# EAGLE design transmitter2 (EAGLE 5.10)
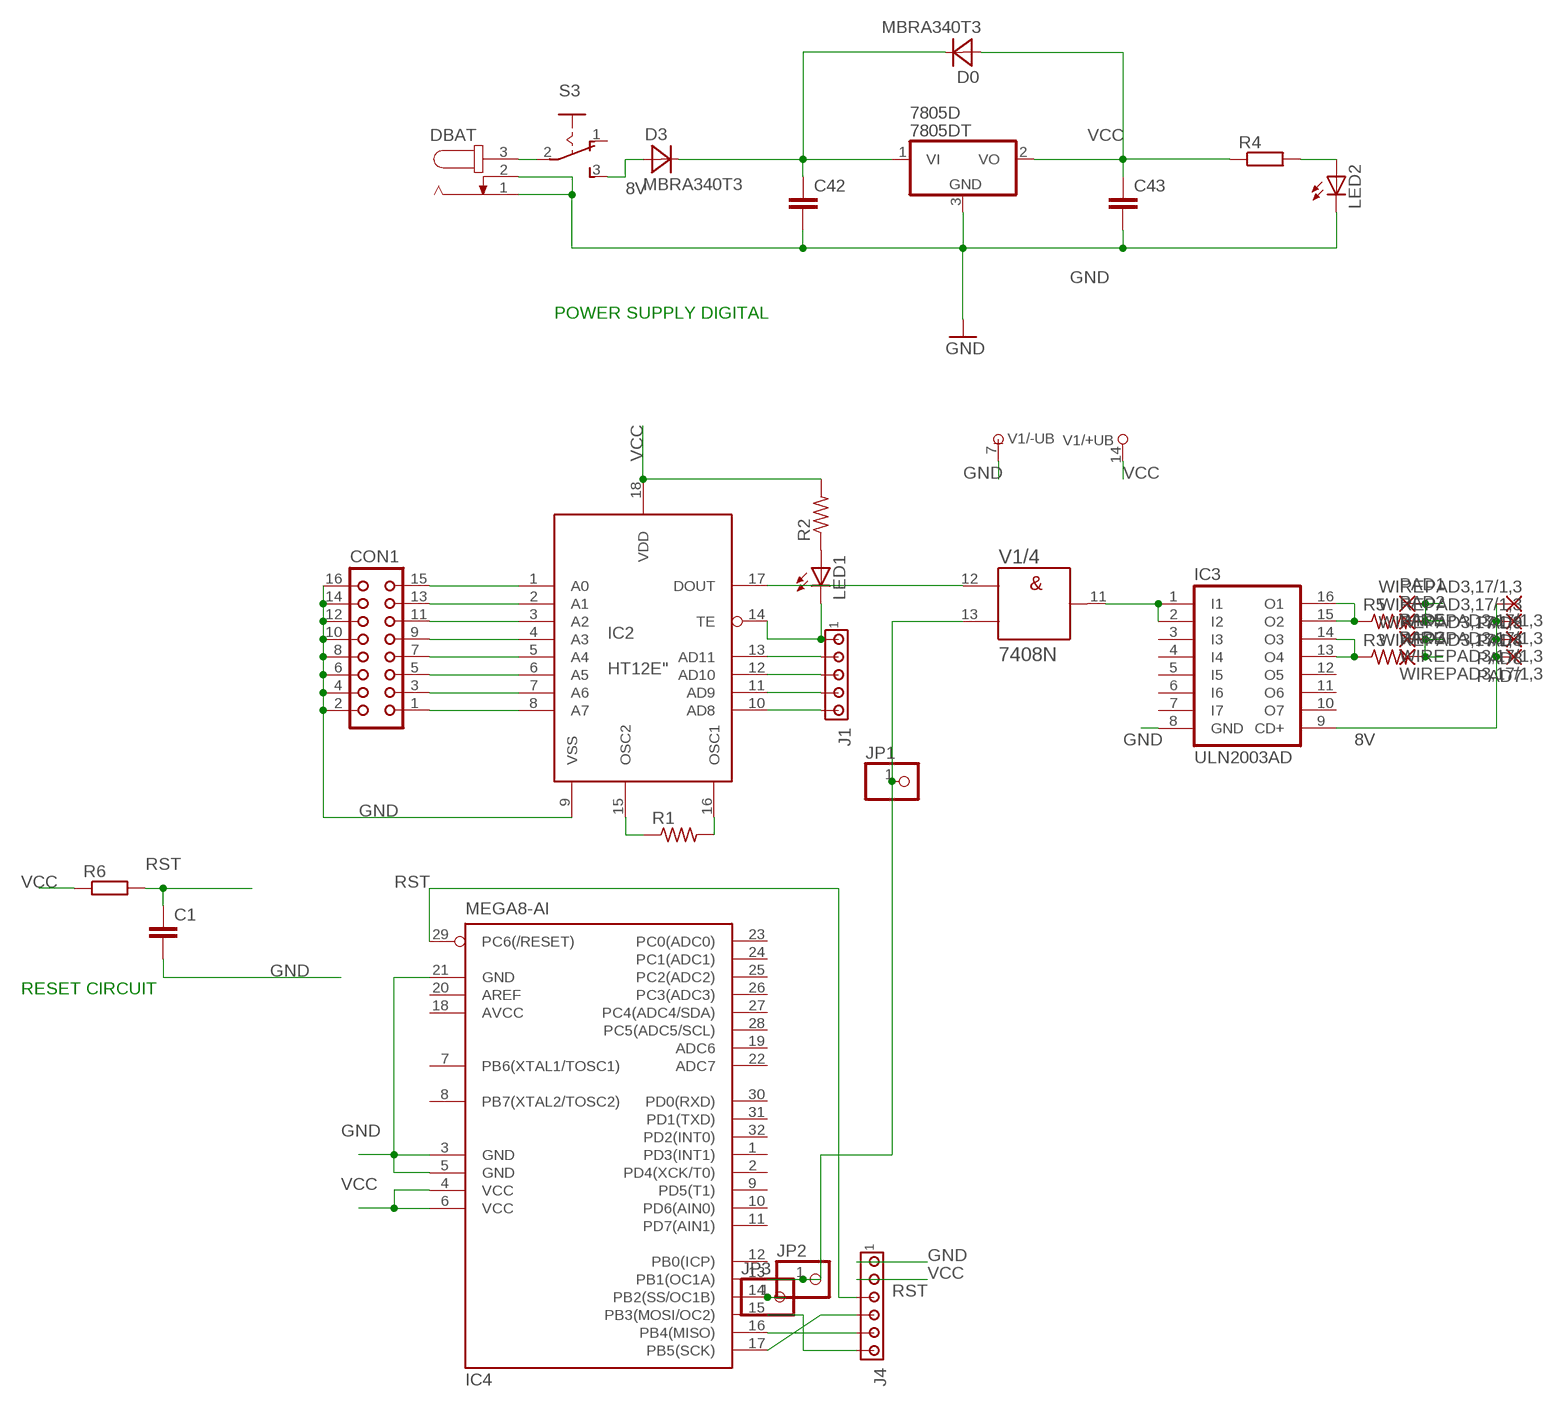
[diagram p0: schematic, sheet 1]

## Parts
7805D  7805DT  [TO252]
C1  C-EUC0603  [C0603]
C42  C-EUC0603  [C0603]
C43  C-EUC0603  [C0603]
CON1  CON16  [CON16]
D0  MBRA340T3  [SMA]
D3  MBRA340T3  [SMA]
DBAT  JACK-PLUG0  [SPC4077]
IC2  HT12E"  [18-DIP-A]
IC3  ULN2003AD  [SO16]
IC4  MEGA8-AI  [TQFP32-08]
J1  MTA05-100  [10X05MTA]
J4  MTA06-100  [10X06MTA]
JP1  PINHD-1X1  [1X01]
JP2  PINHD-1X1  [1X01]
JP3  PINHD-1X1  [1X01]
LED1  LED3MM  [LED3MM]
LED2  LED3MM  [LED3MM]
PAD1  WIREPAD3,17/1,3  [3,17/1,3]
PAD2  WIREPAD3,17/1,3  [3,17/1,3]
PAD3  WIREPAD3,17/1,3  [3,17/1,3]
PAD4  WIREPAD3,17/1,3  [3,17/1,3]
PAD5  WIREPAD3,17/1,3  [3,17/1,3]
PAD7  WIREPAD3,17/1,3  [3,17/1,3]
PAD8  WIREPAD3,17/1,3  [3,17/1,3]
PAD9  WIREPAD3,17/1,3  [3,17/1,3]
R1  R-US_VMTA55  [VMTA55]
R2  R-US_M1206  [M1206]
R3  R-US_0309/12  [0309/12]
R4  R-EU_R0603  [R0603]
R5  R-US_0309/12  [0309/12]
R6  R-EU_R0603  [R0603]
S3  255SB  [255SB]
V1  7408N  [DIL14]

## Nets
8V: D3.A IC3.9(CD+) PAD4.1(P) PAD7.1(P) PAD8.1(P) PAD9.1(P) S3.3(S)
GND: 7805D.3(GND) C1.2 C42.2 C43.2 CON1.2 CON1.4 CON1.6 CON1.8 CON1.10 CON1.12 CON1.14 CON1.16 DBAT.1 DBAT.2 IC2.9(VSS) IC3.8(GND) IC4.3(GND) IC4.5(GND) IC4.21(GND) J4.6 LED2.K(C) V1.7(/-UB:-UB)
N$1: CON1.15 IC2.1(A0)
N$2: CON1.13 IC2.2(A1)
N$3: CON1.11 IC2.3(A2)
N$4: CON1.9 IC2.4(A3)
N$5: CON1.7 IC2.5(A4)
N$6: DBAT.3 S3.2(P)
N$7: IC3.15(O2) IC3.16(O1) R5.1
N$8: LED2.A R4.2
N$9: CON1.5 IC2.6(A5)
N$10: CON1.3 IC2.7(A6)
N$11: CON1.1 IC2.8(A7)
N$12: IC2.13(AD11) J1.2
N$13: IC2.12(AD10) J1.3
N$14: IC2.11(AD9) J1.4
N$15: IC2.10(AD8) J1.5
N$16: IC2.16(OSC1) R1.2
N$17: IC2.15(OSC2) R1.1
N$18: IC4.13(PB1(OC1A)) JP1.1 JP2.1 V1.13(/4:B)
N$19: IC4.14(PB2(SS/OC1B)) JP3.1
N$20: IC3.13(O4) IC3.14(O3) R3.1
N$21: PAD3.1(P) PAD5.1(P) R3.2
N$22: IC2.17(DOUT) V1.12(/4:A)
N$24: LED1.A R2.1
N$25: IC3.1(I1) IC3.2(I2) V1.11(/4:Y)
N$26: IC4.15(PB3(MOSI/OC2)) J4.1
N$27: PAD1.1(P) PAD2.1(P) R5.2
N$28: IC4.16(PB4(MISO)) J4.2
N$29: IC4.17(PB5(SCK)) J4.3
RST: C1.1 IC4.29(PC6(/RESET)) J4.4 R6.2
TE: IC2.14(TE) J1.1 LED1.K(C)
VCC: 7805D.2(VO) C43.1 D0.A IC2.18(VDD) IC4.4(VCC) IC4.6(VCC) J4.5 R2.2 R4.1 R6.1 V1.14(/+UB:+UB)
VI(5D): 7805D.1(VI) C42.1 D0.C D3.C
Unconnected: IC3.3(I3) IC3.4(I4) IC3.5(I5) IC3.6(I6) IC3.7(I7) IC3.10(O7) IC3.11(O6) IC3.12(O5) IC4.1(PD3(INT1)) IC4.2(PD4(XCK/T0)) IC4.7(PB6(XTAL1/TOSC1)) IC4.8(PB7(XTAL2/TOSC2)) IC4.9(PD5(T1)) IC4.10(PD6(AIN0)) IC4.11(PD7(AIN1)) IC4.12(PB0(ICP)) IC4.19(ADC6) IC4.20(AREF) IC4.22(ADC7) IC4.23(PC0(ADC0)) IC4.24(PC1(ADC1)) IC4.25(PC2(ADC2)) IC4.26(PC3(ADC3)) IC4.27(PC4(ADC4/SDA)) IC4.28(PC5(ADC5/SCL)) IC4.30(PD0(RXD)) IC4.31(PD1(TXD)) IC4.32(PD2(INT0)) S3.1(O) V1.1(/1:A) V1.2(/1:B) V1.3(/1:Y) V1.4(/2:A) V1.5(/2:B) V1.6(/2:Y) V1.8(/3:Y) V1.9(/3:A) V1.10(/3:B)

## Notes on the sheet
- POWER SUPPLY DIGITAL
- RESET CIRCUIT

## Power pins joined to a net without a drawn wire
AVCC: IC4.18(AVCC)

## Library data of the parts
7805D = linear:78*: Positive VOLTAGE REGULATOR Source: http://cache.national.com/ds/LM/LM78L05.pdf http://www.fairchildsemi.com/ds/LM/LM7805.pdf
C1 C42 C43 = rcl:C-EU: CAPACITOR, European symbol
CON1 = con-harting:CON16: CONNECTOR
D0 D3 = diode:MBRA340T3: Surface Mount Schottky Power Rectifier Source: http://www.onsemi.com/pub_link/Collateral/MBRA340T3-D.PDF
DBAT = con-jack:JACK-PLUG: DC POWER JACK Power Jack, DC, Right Angle, Through Hole, Rated 5A at 16VDC, PC Terminals Distributor: Farnell (www.Farnell.de) Drawing: 84N1161.pdf / 84N1162.pdf Manufacturer: SPC Technology (www.spctechnology.com) Type: SPC4077 / SPC 4078
IC2 = holtek (2):HT12E: transmitter = encoder ic
IC3 = uln-udn:ULN2003A: DRIVER ARRAY
IC4 = atmel:MEGA8: MICROCONTROLLER 8 Kbytes FLASH, 1 kbytes SRAM, 512 bytes EEPROM, USART, 6-channel 10 bit ADC, 2-channel 8 bit ADC Pin compatible with Atmega48, ATMega88, ATMega168 Source: avr.lbr
J1 = con-amp:MTA05-100: AMP connector
J4 = con-amp:MTA06-100: AMP connector
JP1-JP3 = pinhead:PINHD-1X1: PIN HEADER
LED1 LED2 = led:LED: LED OSRAM: - CHIPLED LG R971, LG N971, LY N971, LG Q971, LY Q971, LO R971, LY R971 LH N974, LH R974 LS Q976, LO Q976, LY Q976 LO Q996 - Hyper CHIPLED LW Q18S LB Q993, LB Q99A, LB R99A - SideLED LS A670, LO A670, LY A670, LG A670, LP A670 LB A673, LV A673, LT A673, LW A673 LH A674 LY A675 LS A676, LA A676, LO A676, LY A676, LW A676 LS A679, LY A679, LG A679 - Hyper Micro SIDELED® LS Y876, LA Y876, LO Y876, LY Y876 LT Y87S - SmartLED LW L88C, LW L88S LB L89C, LB L89S, LG L890 LS L89K, LO L89K, LY L89K LS L896, LA L896, LO L896, LY L896 - TOPLED LS T670, LO T670, LY T670, LG T670, LP T670 LSG T670, LSP T670, LSY T670, LOP T670, LYG T670 LG T671, LOG T671, LSG T671 LB T673, LV T673, LT T673, LW T673 LH T674 LS T676, LA T676, LO T676, LY T676, LB T676, LH T676, LSB T676, LW T676 LB T67C, LV T67C, LT T67C, LS T67K, LO T67K, LY T67K, LW E67C LS E67B, LA E67B, LO E67B, LY E67B, LB E67C, LV E67C, LT E67C LW T67C LS T679, LY T679, LG T679 LS T770, LO T770, LY T770, LG T770, LP T770 LB T773, LV T773, LT T773, LW T773 LH T774 LS E675, LA E675, LY E675, LS T675 LS T776, LA T776, LO T776, LY T776, LB T776 LHGB T686 LT T68C, LB T68C - Hyper Mini TOPLED® LB M676 - Mini TOPLED Santana® LG M470 LS M47K, LO M47K, LY M47K Source: http://www.osram.convergy.de LUXEON: - LUMILED® LXK2-PW12-R00, LXK2-PW12-S00, LXK2-PW14-U00, LXK2-PW14-V00 LXK2-PM12-R00, LXK2-PM12-S00, LXK2-PM14-U00 LXK2-PE12-Q00, LXK2-PE12-R00, LXK2-PE12-S00, LXK2-PE14-T00, LXK2-PE14-U00 LXK2-PB12-K00, LXK2-PB12-L00, LXK2-PB12-M00, LXK2-PB14-N00, LXK2-PB14-P00, LXK2-PB14-Q00 LXK2-PR12-L00, LXK2-PR12-M00, LXK2-PR14-Q00, LXK2-PR14-R00 LXK2-PD12-Q00, LXK2-PD12-R00, LXK2-PD12-S00 LXK2-PH12-R00, LXK2-PH12-S00 LXK2-PL12-P00, LXK2-PL12-Q00, LXK2-PL12-R00 Source: www.luxeon.com KINGBRIGHT: KA-3528ASYC Source: www.kingbright.com
PAD1-PAD5 PAD7-PAD9 = wirepad:WIREPAD: Wire PAD connect wire on PCB
R1-R3 R5 = rcl:R-US_: RESISTOR, American symbol
R4 R6 = resistor:R-EU_: RESISTOR, European symbol
S3 = switch:255SB: SLIDING SWITCH Distributor Buerklin, 11G810
V1 = 74ttl-din:74*08: Quad 2-input AND gate

## Board
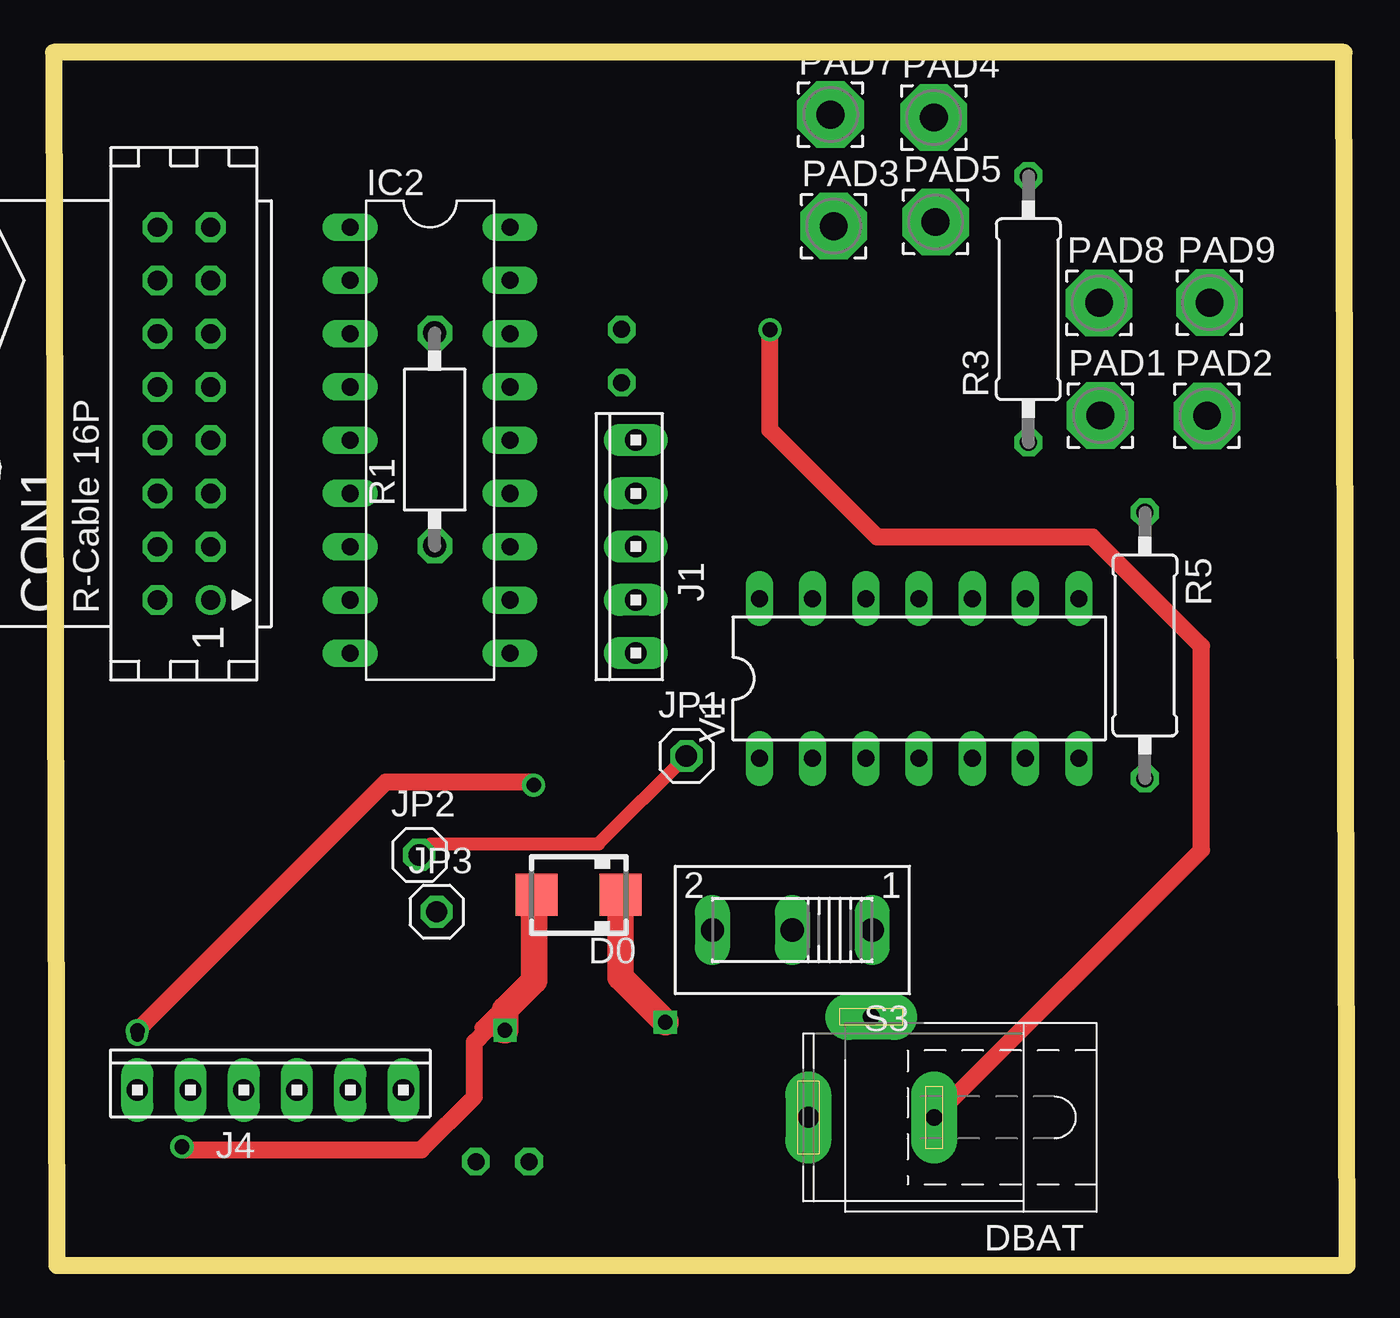
[diagram p1: board, top side]
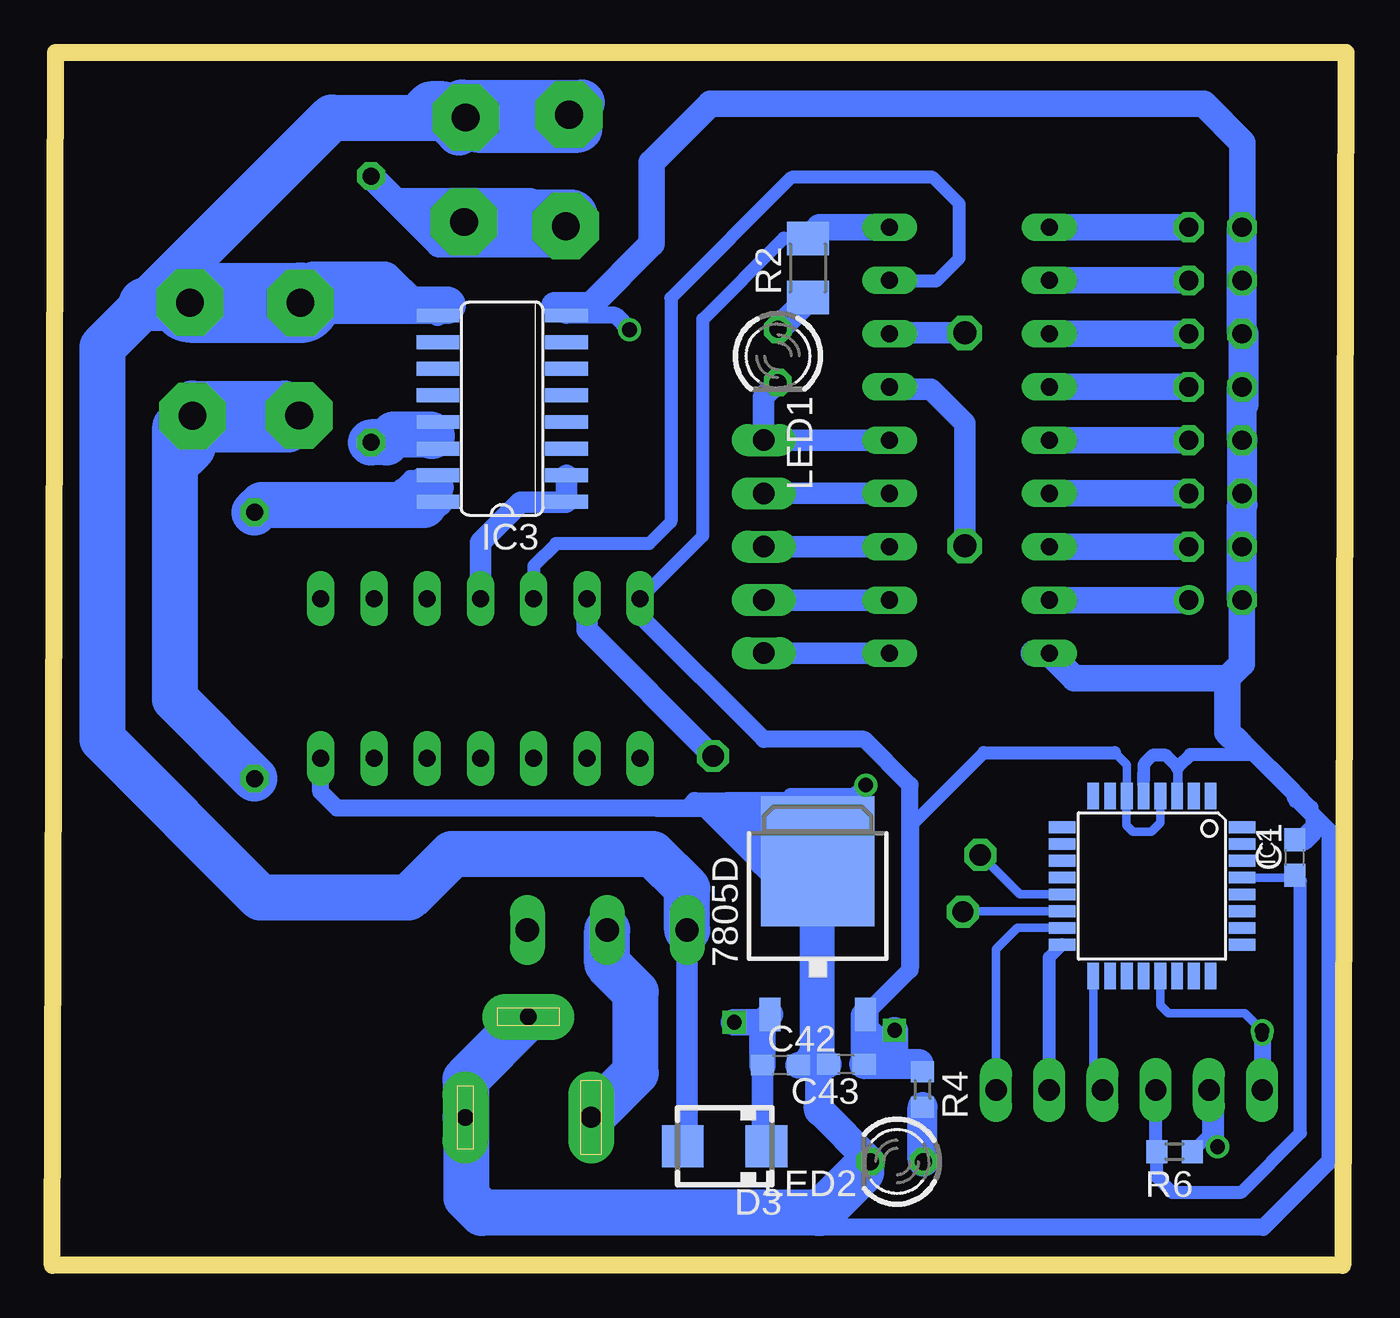
[diagram p2: board, bottom side, seen from below]

Size 61.72 x 57.85 mm. Coordinates in mm from the lower left corner, seen from the top.
Outline: 0.16,0 61.72,0 61.56,57.85 0,57.85 0.16,0
Copper layers (1*16): Top 0.035mm / dielectric 1.5mm / Bottom 0.035mm
Design rules "default": minimum track width 10mil, minimum drill 24mil, track to track 8mil, track to pad 8mil, pad to pad 8mil, via to via 8mil, smd to smd 8mil, copper to edge 40mil, drill to drill 8mil, minimum pad ring 10mil, minimum via ring 8mil, stop-mask expansion 4mil, vias tented up to drill 0mil, thermal gap 10mil

### Footprints (pad centres in the part's own frame; a part is rotated, then mirrored left to right if it is on the bottom)
TO252 = smd 1 x 1.6: 1 -2.28,-4.8; 2 2.28,-4.8 | smd 5.4 x 6.2: 3 0,2.5
C0603 = smd 1.1 x 1: 1 -0.85,0; 2 0.85,0
CON16 = drill 0.914 round: 1 -8.89,-1.27 | drill 0.914 octagon: 2 -8.89,1.27; 3 -6.35,-1.27; 4 -6.35,1.27; 5 -3.81,-1.27; 6 -3.81,1.27; 7 -1.27,-1.27; 8 -1.27,1.27; 9 1.27,-1.27; 10 1.27,1.27; 11 3.81,-1.27; 12 3.81,1.27; 13 6.35,-1.27; 14 6.35,1.27; 15 8.89,-1.27; 16 8.89,1.27
SMA = smd 2 x 2: A 2,0; C -2,0
SPC4077 = drill 0.8 pad 2.184 long: 1 -3,0; 2 0,-4.8 | drill 1 pad 2.184 long: 3 3,0
18-DIP-A = drill 0.813 long: 1 -10.16,-3.81; 2 -7.62,-3.81; 3 -5.08,-3.81; 4 -2.54,-3.81; 5 0,-3.81; 6 2.54,-3.81; 7 5.08,-3.81; 8 7.62,-3.81; 9 10.16,-3.81; 10 10.16,3.81; 11 7.62,3.81; 12 5.08,3.81; 13 2.54,3.81; 14 0,3.81; 15 -2.54,3.81; 16 -5.08,3.81; 17 -7.62,3.81; 18 -10.16,3.81
SO16 = smd 0.66 x 2.032: 1 -4.445,-3.073; 2 -3.175,-3.073; 3 -1.905,-3.073; 4 -0.635,-3.073; 5 0.635,-3.073; 6 1.905,-3.073; 7 3.175,-3.073; 8 4.445,-3.073; 9 4.445,3.073; 10 3.175,3.073; 11 1.905,3.073; 12 0.635,3.073; 13 -0.635,3.073; 14 -1.905,3.073; 15 -3.175,3.073; 16 -4.445,3.073
TQFP32-08 = smd 1.27 x 0.559: 1 -4.293,2.8; 2 -4.293,2; 3 -4.293,1.2; 4 -4.293,0.4; 5 -4.293,-0.4; 6 -4.293,-1.2; 7 -4.293,-2; 8 -4.293,-2.8; 17 4.293,-2.8; 18 4.293,-2; 19 4.293,-1.2; 20 4.293,-0.4; 21 4.293,0.4; 22 4.293,1.2; 23 4.293,2; 24 4.293,2.8 | smd 0.559 x 1.27: 9 -2.8,-4.293; 10 -2,-4.293; 11 -1.2,-4.293; 12 -0.4,-4.293; 13 0.4,-4.293; 14 1.2,-4.293; 15 2,-4.293; 16 2.8,-4.293; 25 2.8,4.293; 26 2,4.293; 27 1.2,4.293; 28 0.4,4.293; 29 -0.4,4.293; 30 -1.2,4.293; 31 -2,4.293; 32 -2.8,4.293
10X05MTA = drill 1.016 long: 1 5.08,0; 2 2.54,0; 3 0,0; 4 -2.54,0; 5 -5.08,0
10X06MTA = drill 1.016 long: 1 6.35,0; 2 3.81,0; 3 1.27,0; 4 -1.27,0; 5 -3.81,0; 6 -6.35,0
1X01 = drill 1.016 octagon: 1 0,0
LED3MM = drill 0.813 octagon: A -1.27,0; K 1.27,0
3,17/1,3 = drill 1.321 pad 3.175 octagon: 1 0,0
VMTA55 = drill 1.1 octagon: 1 -5.08,0; 2 5.08,0
M1206 = smd 1.6 x 2: 1 -1.4,0; 2 1.4,0
0309/12 = drill 0.813 octagon: 1 -6.35,0; 2 6.35,0
R0603 = smd 1 x 1.1: 1 -0.85,0; 2 0.85,0
255SB = drill 1.118 long: 1 -3.81,0; 2 0,0; 3 3.81,0
DIL14 = drill 0.813 long: 1 -7.62,-3.81; 2 -5.08,-3.81; 3 -2.54,-3.81; 4 0,-3.81; 5 2.54,-3.81; 6 5.08,-3.81; 7 7.62,-3.81; 8 7.62,3.81; 9 5.08,3.81; 10 2.54,3.81; 11 0,3.81; 12 -2.54,3.81; 13 -5.08,3.81; 14 -7.62,3.81

### Placement (x,y rotation side)
7805D  25.2,16.77 0 bottom
C1  2.43,19.45 90 bottom
C42  26.98,9.55 0 bottom
C43  23.84,9.59 180 bottom
CON1  6.23,40.62 90 top
D0  25.05,17.67 180 top
D3  29.64,5.68 180 bottom
DBAT  39.01,7.05 180 top
IC2  17.96,39.35 270 top
IC3  40.26,40.86 90 bottom
IC4  9.26,18.09 270 bottom
J1  27.79,34.28 90 top
J4  10.35,8.36 0 top
JP1  30.19,24.29 0 top
JP2  17.45,19.57 0 top
JP3  18.28,16.86 0 top
LED1  27.1,43.37 270 bottom
LED2  21.42,4.95 180 bottom
PAD1  49.94,40.53 0 top
PAD2  55.03,40.52 0 top
PAD3  37.22,49.56 0 top
PAD4  42,54.74 0 top
PAD5  42.08,49.76 0 top
PAD7  37.07,54.88 0 top
PAD8  49.88,45.91 0 top
PAD9  55.15,45.91 0 top
R1  18.19,39.39 90 top
R2  25.67,47.57 90 bottom
R3  46.51,45.6 90 top
R4  20.2,8.39 270 bottom
R5  52.07,29.56 270 top
R6  8.18,5.42 180 bottom
S3  35.25,15.99 180 top
V1  41.3,27.99 0 top

### Tracks (layer width: path | path; a pad name or v marks a point on that pad's centre or on a via)
8V
  Bottom 1.016: 49.87,45.8 43.83,45.8 IC3.9 | D3.A 31.44,5.88 S3.3
  Bottom 1.676: 49.3,46.45 49.3,46.94 49.25,46.99
  Bottom 1.778: 49.25,46.99 45.89,46.99 44.68,45.78 42.92,45.78 42.9,45.8 49.87,45.8
  Bottom 2.184: 55.22,45.84 PAD9.1 | PAD4.1 48.39,54.74 57.29,45.84 59.33,43.8 59.33,25.08 51.79,17.54 44.73,17.54 42.66,19.61 33.08,19.61 31.44,17.97 S3.3 | PAD4.1 42.41,54.74 43.04,55.37 43.68,55.37 43.98,55.07 43.36,55.07 42.32,54.03 42.32,55.31 42.18,55.45 36.46,55.45 | PAD7.1 36.59,54.2 36.62,54.17 41.43,54.17 PAD4.1
  Bottom 2.54: 57.29,45.84 55.22,45.84 | PAD8.1 49.84,45.91 49.3,46.45
  Bottom 3.81: PAD9.1 PAD8.1
GND  (via drill 0.6, 0.7)
  Top 0.813: v4,10.97 v4,11.19 15.85,23.04 22.77,23.04 v22.91,22.9 | v34.18,44.62 34.18,39.85 39.3,34.73 49.57,34.73 54.77,29.53 54.77,19.81 DBAT.1
  Bottom 0.406: 8.88,13.78 IC4.21 8.86,12.4 8.48,12.02 4.83,12.02 v4,11.19 | 7.99,23.8 7.99,22.45 IC4.3 8.06,23.74 | IC4.5 9.66,22.81 9.58,22.89 9.7,22.89 9.76,22.95 9.76,23.47 9.75,23.48 9.75,23.34 9.55,23.14 9.55,23.92 9.59,23.96
  Bottom 0.61: 2.43,22.33 4.47,24.36 | 5.14,24.36 7.43,24.36 7.99,23.8 | 4.47,24.36 5.14,24.36 | 8.06,23.74 8.06,23.79 8.59,24.32 9.23,24.32 9.59,23.96 | 5.14,24.36 5.14,24.69 | 5.14,24.69 arc90 4.8,25.03 4.8,24.9 | 4.8,24.9 4.8,24.69 arc-90 4.47,24.36 | 5.14,24.69 5.14,24.91 | 2.43,22.65 4.76,24.98 4.76,24.94 arc90 4.8,24.9 | 2.43,22.65 2.43,22.12 | 1.63,20.67 1.63,21.85 2.43,22.65 | 37.77,45.8 37.29,45.32 35.97,45.32 35.99,45.3 | 4.94,36.27 4.96,36.28 CON1.6 | 32.97,21.78 32.88,21.69 30.12,21.69 29.55,22.26 26.7,22.26 26.51,22.45 23.36,22.45
  Bottom 0.813: 4.88,44.43 CON1.12 | 4.88,41.05 4.96,41.05 CON1.10 | 4.94,39.35 CON1.8 | 4.96,36.27 4.94,36.27 | CON1.2 4.9,31.73 | 31.08,22.16 arc45 30.9,22.09 28.12,19.3 25.27,19.3 arc45 7805D.3 | 31.08,22.16 28.61,22.16 arc45 28.43,22.09 27.11,20.77 26.46,20.11 27.9,20.11 arc-45 28.02,20.06 arc-45 28.05,20.15 29.58,21.67 28.93,21.67 arc45 28.75,21.6 28.69,21.53 arc-45 28.63,21.39 28,20.76 arc45 27.86,20.7 27.66,20.5 27.66,19.55 arc45 27.73,19.37 28,19.1 arc-45 27.97,19.03 27.11,18.17 | J4.6 v4,10.97 | v22.91,22.9 23.36,22.45 24.04,21.77 24.84,21.77 | 2.43,22.33 0.76,20.65 0.76,5 3.95,1.81 25.25,1.81 24.78,2.28 24.78,2.8 | 31.08,22.16 31.44,21.8 48.14,21.8 48.92,22.58 V1.7 | IC3.8 34.86,45.3 v34.18,44.62
  Bottom 1.016: 23.12,4.46 23.12,4.52 LED2.K | C1.2 2,20.3 1.63,20.67
  Bottom 1.27: C42.2 24.73,9.55 C43.2 | C43.2 25.42,9.6 25.46,9.63 | C43.2 25.12,9.6 25.16,9.56 25.16,7.57 | CON1.2 4.96,28.69 5.66,27.99 | 5.66,27.99 12.95,27.99 IC2.9 14.89,29.19 | 24.84,21.77 26.11,21.77 27.11,20.77 | 5.66,27.99 5.66,25.43 5.14,24.91 | CON1.16 4.94,49.53 4.94,53.54 6.79,55.39 30.33,55.39 33.13,52.59 33.13,48.71 36.04,45.8 37.77,45.8
  Bottom 1.422: CON1.16 CON1.14 CON1.12 | 4.88,41.05 4.88,44.43 | CON1.8 CON1.10 | 4.94,36.27 4.94,39.35 | 4.96,36.27 CON1.4 CON1.2 | 25.16,7.57 25.16,7.52 arc-45 25.08,7.34 LED2.K
  Bottom 1.676: 25.46,9.63 25.46,9.74 25.4,9.8 25.4,9.87 25.3,9.97 25.28,9.97 25.21,9.9 7805D.3
  Bottom 2.184: DBAT.1 42.01,8.85 DBAT.2 39.03,11.85 41.97,8.91 41.97,3.24 41.23,2.5 25.08,2.5 24.78,2.8 23.12,4.46
N$1
  Bottom 1.27: CON1.15 IC2.1
N$2
  Bottom 1.27: CON1.13 IC2.2
N$3
  Bottom 1.27: CON1.11 IC2.3
N$4
  Bottom 1.27: CON1.9 IC2.4
N$5
  Bottom 1.27: CON1.7 IC2.5
N$6
  Bottom 2.184: S3.2 35.25,14.39 33.89,13.03 33.89,9.18 DBAT.3
N$7
  Bottom 0.61: IC3.16 44.37,36.41 45.14,37.18 45.11,37.18 44.66,37.63 43.39,37.63 IC3.15
  Bottom 1.422: IC3.16 43.34,37.03 43.27,37.1 43.67,37.1 43.67,36.36 43.72,36.31 43.72,36.91 44.11,37.3 44.11,36.38 43.99,36.26
  Bottom 2.184: 43.99,36.26 51.72,36.26 R5.1
N$8
  Bottom 1.422: R4.2 20.2,5.06 arc-45 LED2.A
N$9
  Bottom 1.27: CON1.5 IC2.6
N$10
  Bottom 1.27: CON1.3 IC2.7
N$11
  Bottom 1.27: CON1.1 IC2.8
N$12
  Bottom 1.016: IC2.13 J1.2
N$13
  Bottom 1.016: IC2.12 J1.3
N$14
  Bottom 1.016: IC2.11 J1.4
N$15
  Bottom 1.016: IC2.10 J1.5
N$16
  Bottom 1.016: R1.2 21.73,44.47 IC2.16
N$17
  Bottom 1.016: R1.1 18.19,40.17 19.8,41.78 21.66,41.78 IC2.15
N$18
  Top 0.61: JP1.1 26.01,20.1 17.98,20.1 JP2.1
  Bottom 0.406: IC4.13 15.57,17.69 JP2.1
  Bottom 1.016: JP1.1 36.22,30.31 V1.13
N$19
  Bottom 0.406: IC4.14 18.25,16.89 JP3.1
N$20
  Bottom 0.61: 43.62,39.56 43.62,39.24 IC3.14 IC3.13
  Bottom 2.184: R3.1 45.79,39.25 45.42,39.62 43.68,39.62 43.62,39.56
N$21
  Bottom 1.27: R3.2 43.26,48.7 36.88,48.7 38.94,50.76 45.16,50.76 43.96,49.56 PAD3.1
  Bottom 2.54: PAD5.1 41.97,49.76 41.69,50.04 36.97,50.04 PAD3.1
N$22
  Bottom 0.61: IC2.17 21.74,46.94 19.55,46.94 18.45,48.04 18.45,50.62 19.72,51.89 26.45,51.89 32.21,46.13 32.21,35.46 33.25,34.42 37.7,34.42 38.76,33.36 V1.12
N$23
  Bottom 0.406: 9.57,23.97 9.68,23.97 9.7,23.95 9.7,23.93 9.71,23.92 9.71,23.94 9.72,23.95 9.72,23.93 9.75,23.9 9.75,23.24
N$24
  Bottom 1.27: R2.1 25.67,46.07 LED1.A
N$25
  Bottom 1.016: IC3.2 IC3.1 39.39,36.4 41.3,34.49 V1.11
N$26
  Bottom 0.406: J4.1 16.7,15.08 15.69,16.09 IC4.15
N$27
  Bottom 2.184: PAD1.1 50.07,40.53 50.65,41.1 55.03,41.1 55.03,40.02 54.87,39.86 50.49,39.86 49.87,40.48 55,40.48 PAD2.1 55.03,38.98 55.85,38.16 | R5.2 55.87,27.01 55.87,38.14 55.85,38.16 | 55.2,40.66 55.85,40.01 55.85,38.16
N$28
  Bottom 0.61: IC4.16 14.16,14.69 J4.2
N$29
  Bottom 0.406: J4.3 12.06,8.8 IC4.17
RST
  Bottom 0.406: IC4.29 2.54,18.49 C1.1
  Bottom 0.61: C1.1 2.18,18.34 2.18,6.31 5.02,3.47 8.29,3.47 9.03,4.21 R6.2 9.08,5.47 J4.4
TE
  Bottom 1.016: IC2.14 J1.1 27.79,41.42 LED1.K
VCC  (via drill 0.7)
  Top 0.61: 21.54,12.19 21.24,12.19 20.38,11.33 20.64,11.33 20.67,11.3 20.98,11.3 21.36,10.92
  Top 0.813: v6.13,5.65 6.28,5.5 17.54,5.5 20.08,8.04 20.08,10.64 20.67,11.23 20.67,11.3
  Top 1.27: v21.54,11.21 21.54,12.19 22.93,13.58 22.93,17.54 D0.A
  Bottom 0.406: 11.04,24.45 10.46,23.87 IC4.6 10.49,22.35 10.49,20.99 10.18,20.68 9.28,20.68 8.86,21.1 IC4.4
  Bottom 0.61: J4.5 6.44,8.26 | 11.04,24.45 17.28,24.45 20.67,21.06 20.67,14.22 7805D.2 | V1.14 30.69,34.79 30.69,45.13 26.83,48.99 25.7,48.99 R2.2 | R6.1 6.54,6.21 J4.5 | J4.5 6.13,7.95 v6.13,5.65
  Bottom 0.813: 7805D.2 20.8,14.09 20.8,22.9 22.98,25.08 27.78,25.08 33.68,30.98 V1.14
  Bottom 1.016: R4.1 20.2,9.3 arc-45 20.27,9.48 20.4,9.6
  Bottom 1.27: C43.1 22.99,11.9 7805D.2 22.92,11.3 21.52,9.9 21.52,11.19 v21.54,11.21 | IC2.18 25.13,49.51 R2.2
  Bottom 1.422: 20.4,9.6 22.97,9.6 arc-45 C43.1
VI(5D)  (via drill 0.7)
  Top 1.27: D0.C 27.05,13.73 v29.19,11.59
  Bottom 1.016: C42.1 27.83,5.86 D3.C
  Bottom 1.27: C42.1 27.83,11.48 | 27.83,11.48 27.83,11.62 7805D.1 | v29.19,11.59 27.94,11.59 27.83,11.48